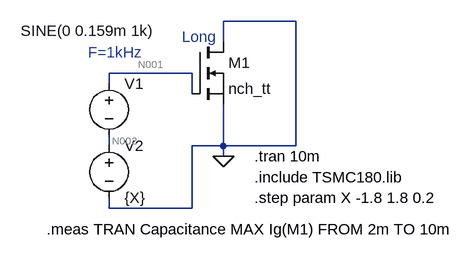
[diagram p0: schematic Prob_2a.asc]
Prob_2a.asc, the LTspice schematic file:
Version 4
SHEET 1 972 680
WIRE 384 32 272 32
WIRE 272 64 272 32
WIRE 224 112 96 112
WIRE 96 128 96 112
WIRE 224 144 224 112
WIRE 96 224 96 208
WIRE 272 224 272 160
WIRE 272 224 224 224
WIRE 384 224 384 32
WIRE 384 224 272 224
WIRE 272 240 272 224
WIRE 96 320 96 304
WIRE 224 320 224 224
WIRE 224 320 96 320
FLAG 272 240 0
SYMBOL voltage 96 112 R0
WINDOW 3 -136 -65 Left 2
WINDOW 123 0 0 Left 0
WINDOW 39 0 0 Left 0
SYMATTR Value SINE(0 0.159m 1k)
SYMATTR InstName V1
SYMBOL nmos 224 64 R0
SYMATTR InstName M1
SYMATTR Value nch_tt
SYMATTR Value2 w=6u l=10u
SYMBOL voltage 96 208 R0
WINDOW 123 0 0 Left 0
WINDOW 39 0 0 Left 0
SYMATTR InstName V2
SYMATTR Value {X}
TEXT 320 272 Left 2 !.include TSMC180.lib
TEXT 64 80 Left 2 ;F=1kHz
TEXT 208 56 Left 2 ;Long
TEXT 320 304 Left 2 !.step param X -1.8 1.8 0.2
TEXT 320 240 Left 2 !.tran 10m
TEXT 0 352 Left 2 !.meas TRAN Capacitance MAX Ig(M1) FROM 2m TO 10m

The netlist it stands for:
* Prob_2a.asc
V1 N001 N002 SINE(0 0.159m 1k)
M1 0 N001 0 0 nch_tt w=6u l=10u
V2 N002 0 {X}
.model NMOS NMOS
.model PMOS PMOS
.lib standard.mos
.include TSMC180.lib
* F=1kHz
* Long
.step param X -1.8 1.8 0.2
.tran 10m
.meas TRAN Capacitance MAX Ig(M1) FROM 2m TO 10m
.backanno
.end

* Results of the author's LTspice run, read from the files saved beside the schematic
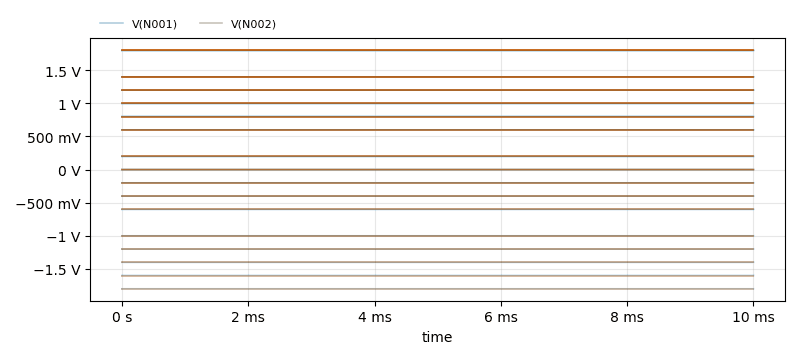
[diagram p1: Transient Analysis of Prob_2a.asc, plotted from the saved traces]
* Transient Analysis, 19 runs:
*   V(N001) [run 1]: min -1.8 V, max -1.8 V, average -1.8 V, rms 1.8 V, last -1.8 V
*   V(N001) [run 2]: min -1.6 V, max -1.6 V, average -1.6 V, rms 1.6 V, last -1.6 V
*   V(N001) [run 3]: min -1.4 V, max -1.4 V, average -1.4 V, rms 1.4 V, last -1.4 V
*   V(N001) [run 4]: min -1.2 V, max -1.2 V, average -1.2 V, rms 1.2 V, last -1.2 V
*   V(N001) [run 5]: min -1 V, max -999.8 mV, average -1 V, rms 1 V, last -1 V
*   V(N001) [run 6]: min -600.2 mV, max -599.8 mV, average -600 mV, rms 600 mV, last -600 mV
*   V(N001) [run 7]: min -400.2 mV, max -399.8 mV, average -400 mV, rms 400 mV, last -400 mV
*   V(N001) [run 8]: min -200.1 mV, max -199.8 mV, average -200 mV, rms 200 mV, last -200 mV
*   V(N002) [run 1]: min -1.8 V, max -1.8 V, average -1.8 V, rms 1.8 V, last -1.8 V
*   V(N002) [run 2]: min -1.6 V, max -1.6 V, average -1.6 V, rms 1.6 V, last -1.6 V
*   V(N002) [run 3]: min -1.4 V, max -1.4 V, average -1.4 V, rms 1.4 V, last -1.4 V
*   V(N002) [run 4]: min -1.2 V, max -1.2 V, average -1.2 V, rms 1.2 V, last -1.2 V
*   V(N002) [run 5]: min -1 V, max -1 V, average -1 V, rms 1 V, last -1 V
*   V(N002) [run 6]: min -600 mV, max -600 mV, average -600 mV, rms 600 mV, last -600 mV
*   V(N002) [run 7]: min -400 mV, max -400 mV, average -400 mV, rms 400 mV, last -400 mV
*   V(N002) [run 8]: min -200 mV, max -200 mV, average -200 mV, rms 200 mV, last -200 mV
* From the log:
*   Measurement: capacitance
*     step  MAX(ig(m1))  FROM  TO
*        1  5.10302e-013  0.002  0.01
*        2  5.08602e-013  0.002  0.01
*        3  5.02376e-013  0.002  0.01
*        4  4.75806e-013  0.002  0.01
*        5  3.91149e-013  0.002  0.01
*        6  2.90346e-013  0.002  0.01
*        7  2.28558e-013  0.002  0.01
*        8  1.9247e-013  0.002  0.01
*        9  1.69193e-013  0.002  0.01
*       10  1.52842e-013  0.002  0.01
*       11  1.44375e-013  0.002  0.01
*       12  4.03547e-013  0.002  0.01
*       13  5.13104e-013  0.002  0.01
*       14  5.13186e-013  0.002  0.01
*       15  5.12777e-013  0.002  0.01
*       16  5.1247e-013  0.002  0.01
*       17  5.1223e-013  0.002  0.01
*       18  5.12048e-013  0.002  0.01
*       19  5.11895e-013  0.002  0.01